# Altium project Fuente.PrjPcb
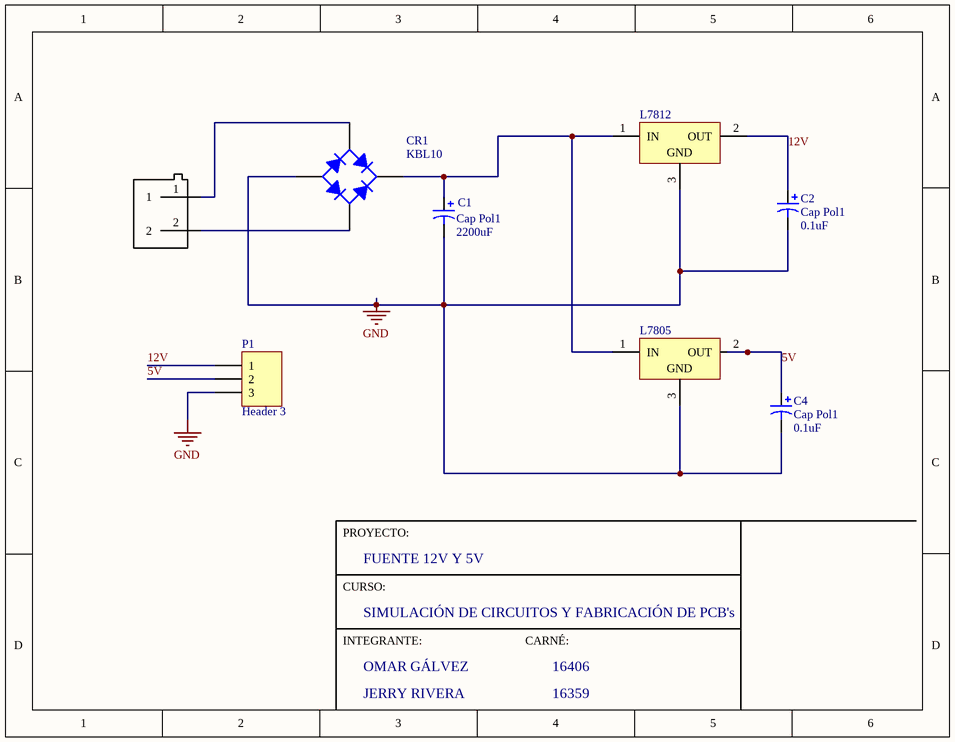
[diagram p0: Esquematico.SchDoc]
1 sheet, 8 parts. Net scope: global (net labels, ports and power ports of the same name join across sheets).
Board file: PCB.PcbDoc

## Sheet Esquematico.SchDoc
size 177 x 137 mm; Integrante 1: OMAR GÁLVEZ; Integrante 2: JERRY RIVERA; Carné 1: 16406; Carné 2: 16359; Curso: SIMULACIÓN DE CIRCUITOS Y FABRICACIÓN DE PCB's; Título: FUENTE 12V Y 5V

### Parts
C1  Cap Pol1  value 2200uF  [CAPPRD500W60D1250HXXX-V]
C2  Cap Pol1  value 0.1uF  [CAPPRD200W50D500HXXX-V]
C4  Cap Pol1  value 0.1uF  [CAPPRD200W50D500HXXX-V]
CR1  KBL10  [D-37]
L7805  L7805ACV  [TO220ABN]  (value not drawn)
L7812  L7812ACV  [TO220ABN]  (value not drawn)
P1  Header 3  [HDR1X3]
TerminalBlock1  Terminales  [TerminalBlock]  (value not drawn)

### Nets
GND: C1.2 C2.2 C4.2 CR1.3(A) L7805.3(GND) L7812.3(GND) P1.3
5V: C4.1 L7805.2(OUT) P1.2
12V: C2.1 L7812.2(OUT) P1.1
NetC1_1: C1.1 CR1.1(K) L7805.1(IN) L7812.1(IN)
NetCR1_2: CR1.2(C) TerminalBlock1.2
NetCR1_4: CR1.4(C) TerminalBlock1.1

### Notes on the sheet
- PROYECTO:
- CURSO:
- INTEGRANTE:
- CARNÉ:

### Library data of the parts
C1 C2 C4 = Cap Pol1: Polarized Capacitor (Radial); Published: 8-Jun-2000; LatestRevisionDate: 17-Jul-2002; LatestRevisionNote: Re-released for DXP Platform.; PackageReference: RB7.6-15; Publisher: Altium Limited; PackageDescription: Polarized Capacitor (Radial); 2 Leads
CR1 = KBL10: 4 Amp Rectifier Bridge; pin to pad: 3>4 4>3; Published: 8-Jun-2000; LatestRevisionDate: 17-Jul-2002; LatestRevisionNote: Re-released for DXP Platform.; DatasheetVersion: E2732B; PackageReference: D-38; Publisher: Altium Limited; PackageDescription: Bridge Rectifier; 4 Terminals; Body 9.4 x 9.4 mm (typ); Pitch 5.08 mm; ComponentLink1Description: Manufacturer Link; ComponentLink1URL: http://www.irf.com/; ComponentLink2Description: Datasheet; ComponentLink2URL: http://www.irf.com/product-info/datasheets/data/1kab-e.pdf
L7805 = L7805ACV: Precision 1A Regulator; Note: Tab is connected to pin 3 (GND).; Published: 24-Aug-2001; LatestRevisionDate: 17-Jul-2002; LatestRevisionNote: Re-released for DXP Platform.; DatasheetVersion: Nov-1999; PackageVersion: Jun-1998; PackageReference: TO220ABN; Publisher: Altium Limited; PackageDescription: TO, Thru-Hole, Vertical, Heatsink Mounted; 3 In-Line Leads; Pitch 2.54 mm; Pin sequence 1, 3, 2; ComponentLink1Description: Manufacturer Link; ComponentLink1URL: http://www.st.com/; ComponentLink2Description: Datasheet; ComponentLink2URL: http://www.st.com/stonline/products/literature/ds/2144/l7805ab.pdf
L7812 = L7812ACV: Precision 1A Regulator; Published: 24-Aug-2001; LatestRevisionDate: 17-Jul-2002; LatestRevisionNote: Re-released for DXP Platform.; DatasheetVersion: Nov-1999; PackageVersion: Jun-1998; PackageReference: TO220ABN; Publisher: Altium Limited; PackageDescription: TO, Thru-Hole, Vertical, Heatsink Mounted; 3 In-Line Leads; Pitch 2.54 mm; Pin sequence 1, 3, 2; ComponentLink1Description: Manufacturer Link; ComponentLink1URL: http://www.st.com/; ComponentLink2Description: Datasheet; ComponentLink2URL: http://www.st.com/stonline/products/literature/ds/2144/l7805ab.pdf
P1 = Header 3: Header, 3-Pin; LatestRevisionDate: 17-Jul-2002; LatestRevisionNote: Re-released for DXP Platform.; Publisher: Altium Limited
TerminalBlock1 = TerminalBlock?